# EAGLE design untitled (EAGLE 7.6.0)
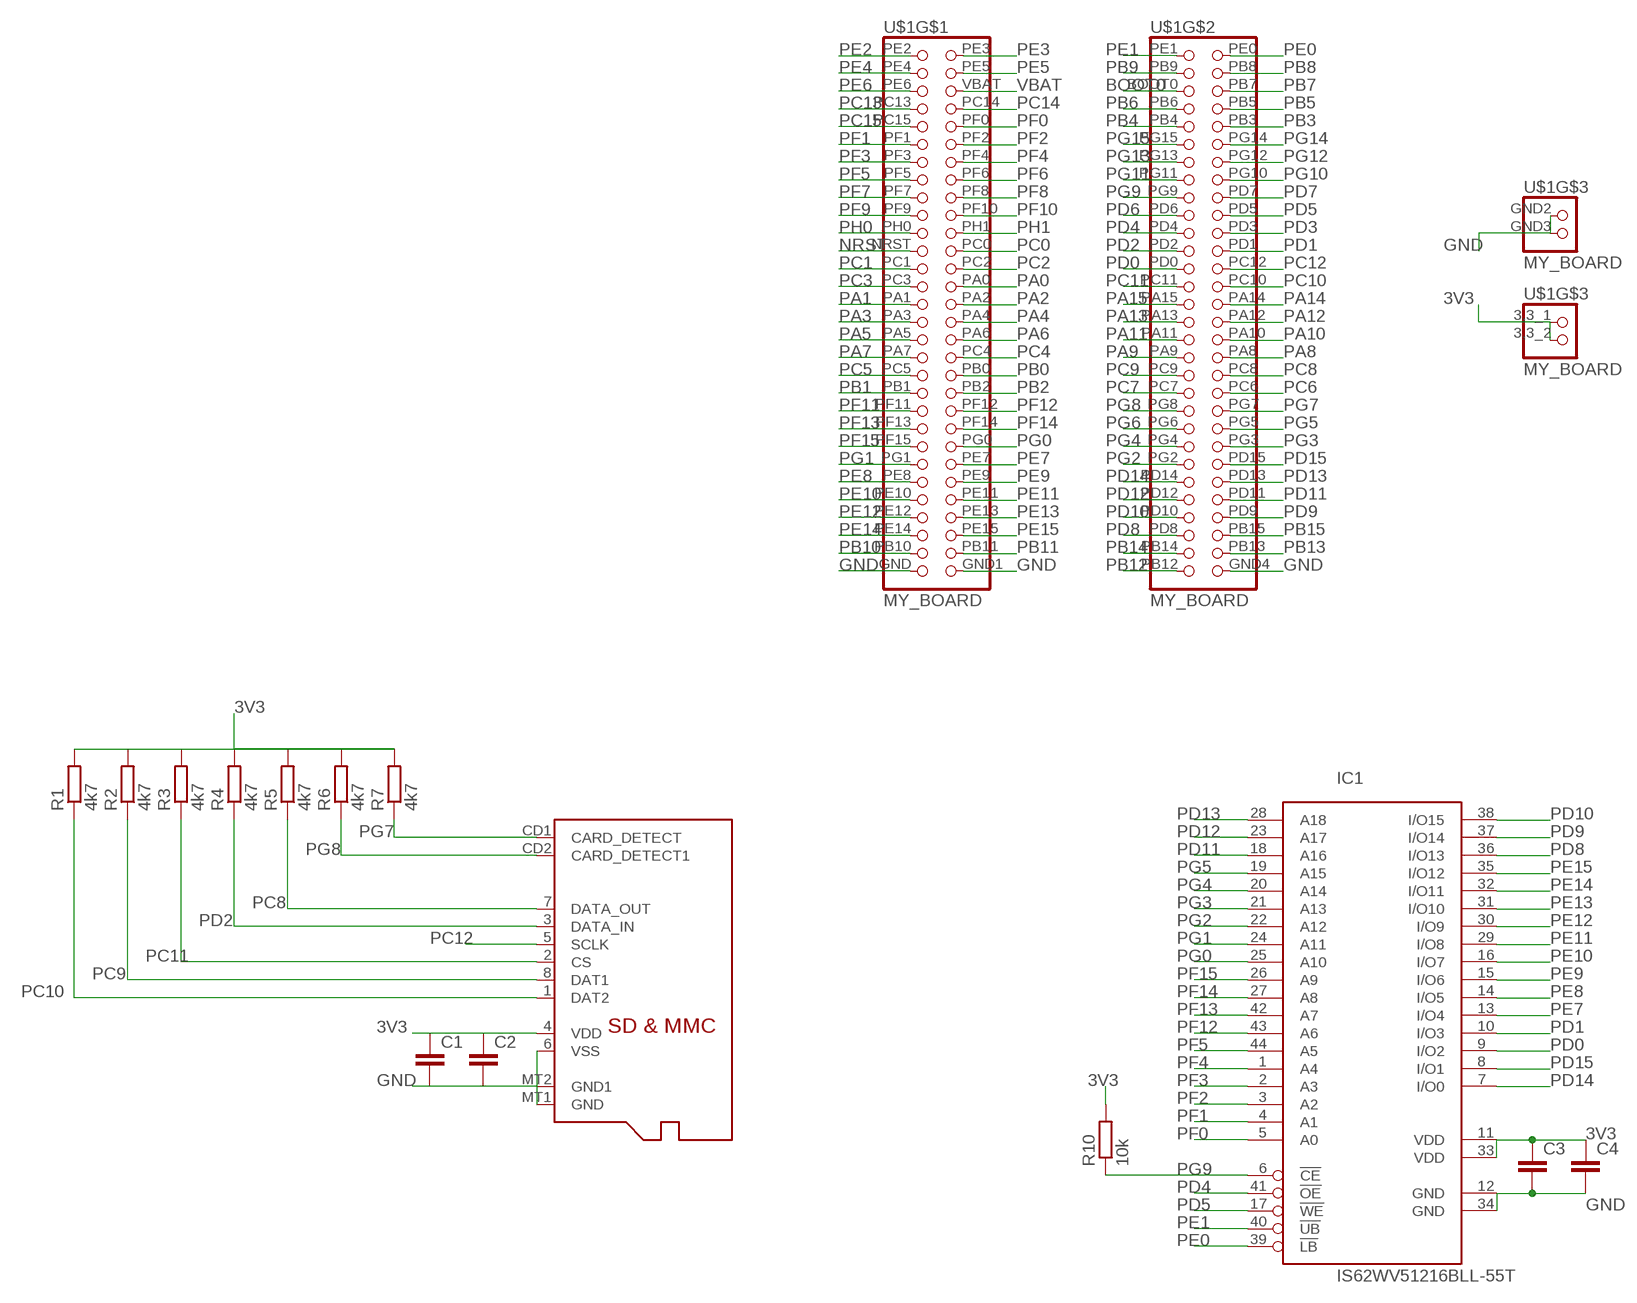
[diagram p0: schematic, sheet 1]

## Parts
C1  C-EUC1206  [C1206]
C2  C-EUC1206  [C1206]
C3  C-EUC1206  [C1206]
C4  C-EUC1206  [C1206]
IC1  IS62WV51216BLL-55T  [TSOP-II-44]
R1  4k7  R-EU_R1206  [R1206]
R2  4k7  R-EU_R1206  [R1206]
R3  4k7  R-EU_R1206  [R1206]
R4  4k7  R-EU_R1206  [R1206]
R5  4k7  R-EU_R1206  [R1206]
R6  4k7  R-EU_R1206  [R1206]
R7  4k7  R-EU_R1206  [R1206]
R10  10k  R-EU_R1206  [R1206]
U$1  MY_BOARD  [MY_BOARD]
U$5  MICROSD  [MICROSD]

## Nets
3V3: C1.1 C2.1 C3.1 C4.1 IC1.11(VDD) IC1.33(VDD) R1.2 R2.2 R3.2 R4.2 R5.2 R6.2 R7.2 R10.2 U$1.3,3_1 U$1.3,3_2 U$5.4(VDD)
BOOT0: U$1.BOOT0
GND: C1.2 C2.2 C3.2 C4.2 IC1.12(GND) IC1.34(GND) U$1.GND U$1.GND1 U$1.GND2 U$1.GND3 U$1.GND4 U$5.6(VSS) U$5.MT1(GND) U$5.MT2(GND1)
NRST: U$1.NRST
PA0: U$1.PA0
PA1: U$1.PA1
PA2: U$1.PA2
PA3: U$1.PA3
PA4: U$1.PA4
PA5: U$1.PA5
PA6: U$1.PA6
PA7: U$1.PA7
PA8: U$1.PA8
PA9: U$1.PA9
PA10: U$1.PA10
PA11: U$1.PA11
PA12: U$1.PA12
PA13: U$1.PA13
PA14: U$1.PA14
PA15: U$1.PA15
PB0: U$1.PB0
PB1: U$1.PB1
PB2: U$1.PB2
PB3: U$1.PB3
PB4: U$1.PB4
PB5: U$1.PB5
PB6: U$1.PB6
PB7: U$1.PB7
PB8: U$1.PB8
PB9: U$1.PB9
PB10: U$1.PB10
PB11: U$1.PB11
PB12: U$1.PB12
PB13: U$1.PB13
PB14: U$1.PB14
PB15: U$1.PB15
PC0: U$1.PC0
PC1: U$1.PC1
PC2: U$1.PC2
PC3: U$1.PC3
PC4: U$1.PC4
PC5: U$1.PC5
PC6: U$1.PC6
PC7: U$1.PC7
PC8: R5.1 U$1.PC8 U$5.7(DATA_OUT)
PC9: R2.1 U$1.PC9 U$5.8(DAT1)
PC10: R1.1 U$1.PC10 U$5.1(DAT2)
PC11: R3.1 U$1.PC11 U$5.2(CS)
PC12: U$1.PC12 U$5.5(SCLK)
PC13: U$1.PC13
PC14: U$1.PC14
PC15: U$1.PC15
PD0: IC1.9(I/O2) U$1.PD0
PD1: IC1.10(I/O3) U$1.PD1
PD2: R4.1 U$1.PD2 U$5.3(DATA_IN)
PD3: U$1.PD3
PD4: IC1.41(!OE) U$1.PD4
PD5: IC1.17(!WE) U$1.PD5
PD6: U$1.PD6
PD7: U$1.PD7
PD8: IC1.36(I/O13) U$1.PD8
PD9: IC1.37(I/O14) U$1.PD9
PD10: IC1.38(I/O15) U$1.PD10
PD11: IC1.18(A16) U$1.PD11
PD12: IC1.23(A17) U$1.PD12
PD13: IC1.28(A18) U$1.PD13
PD14: IC1.7(I/O0) U$1.PD14
PD15: IC1.8(I/O1) U$1.PD15
PE0: IC1.39(!LB) U$1.PE0
PE1: IC1.40(!UB) U$1.PE1
PE2: U$1.PE2
PE3: U$1.PE3
PE4: U$1.PE4
PE5: U$1.PE5
PE6: U$1.PE6
PE7: IC1.13(I/O4) U$1.PE7
PE8: IC1.14(I/O5) U$1.PE8
PE9: IC1.15(I/O6) U$1.PE9
PE10: IC1.16(I/O7) U$1.PE10
PE11: IC1.29(I/O8) U$1.PE11
PE12: IC1.30(I/O9) U$1.PE12
PE13: IC1.31(I/O10) U$1.PE13
PE14: IC1.32(I/O11) U$1.PE14
PE15: IC1.35(I/O12) U$1.PE15
PF0: IC1.5(A0) U$1.PF0
PF1: IC1.4(A1) U$1.PF1
PF2: IC1.3(A2) U$1.PF2
PF3: IC1.2(A3) U$1.PF3
PF4: IC1.1(A4) U$1.PF4
PF5: IC1.44(A5) U$1.PF5
PF6: U$1.PF6
PF7: U$1.PF7
PF8: U$1.PF8
PF9: U$1.PF9
PF10: U$1.PF10
PF11: U$1.PF11
PF12: IC1.43(A6) U$1.PF12
PF13: IC1.42(A7) U$1.PF13
PF14: IC1.27(A8) U$1.PF14
PF15: IC1.26(A9) U$1.PF15
PG0: IC1.25(A10) U$1.PG0
PG1: IC1.24(A11) U$1.PG1
PG2: IC1.22(A12) U$1.PG2
PG3: IC1.21(A13) U$1.PG3
PG4: IC1.20(A14) U$1.PG4
PG5: IC1.19(A15) U$1.PG5
PG6: U$1.PG6
PG7: R7.1 U$1.PG7 U$5.CD1(CARD_DETECT)
PG8: R6.1 U$1.PG8 U$5.CD2(CARD_DETECT1)
PG9: IC1.6(!CE) R10.1 U$1.PG9
PG10: U$1.PG10
PG11: U$1.PG11
PG12: U$1.PG12
PG13: U$1.PG13
PG14: U$1.PG14
PG15: U$1.PG15
PH0: U$1.PH0
PH1: U$1.PH1
VBAT: U$1.VBAT

## Library data of the parts
C1-C4 = resistor:C-EU: CAPACITOR, European symbol
IC1 = memory-issi-asynsram:IS62WV51216BLL-*: 512k x 16 low voltage, ultra low power CMOS static RAM 55ns access time 3.6V power supply
R1-R7 R10 = resistor:R-EU_: RESISTOR, European symbol
U$1 = Stworzone:MY_BOARD
U$5 = adafruit:MICROSD: Micro-SD / Transflash card holder with SPI pinout For the 3M # 2908-05WB-MG and/or 4UCON #19656 push-push type

## Board
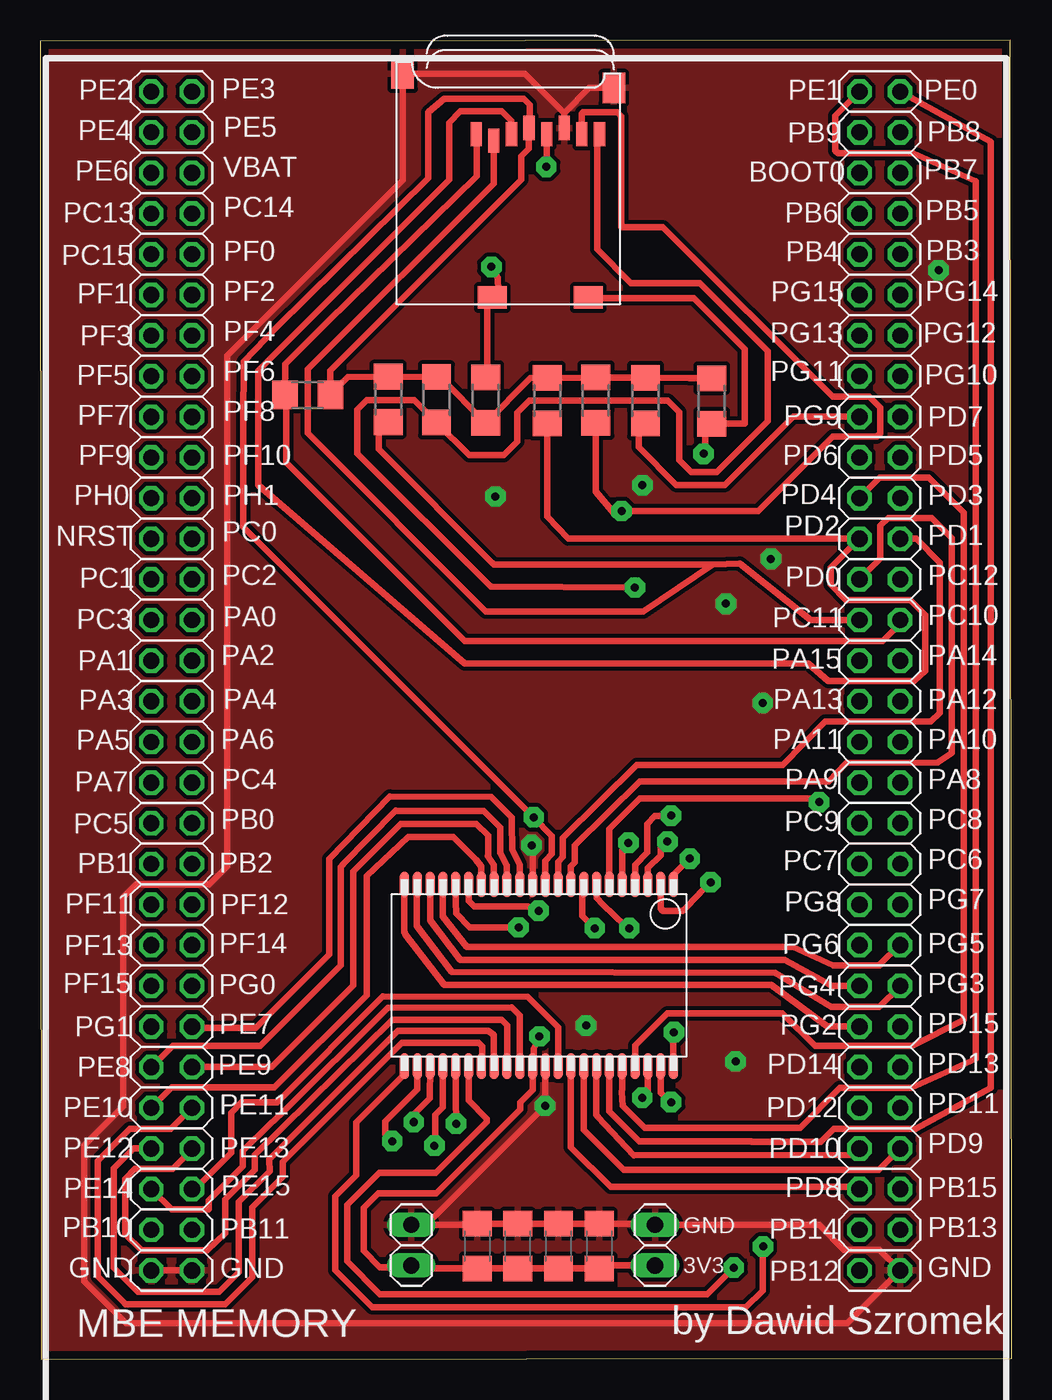
[diagram p1: board, top side]
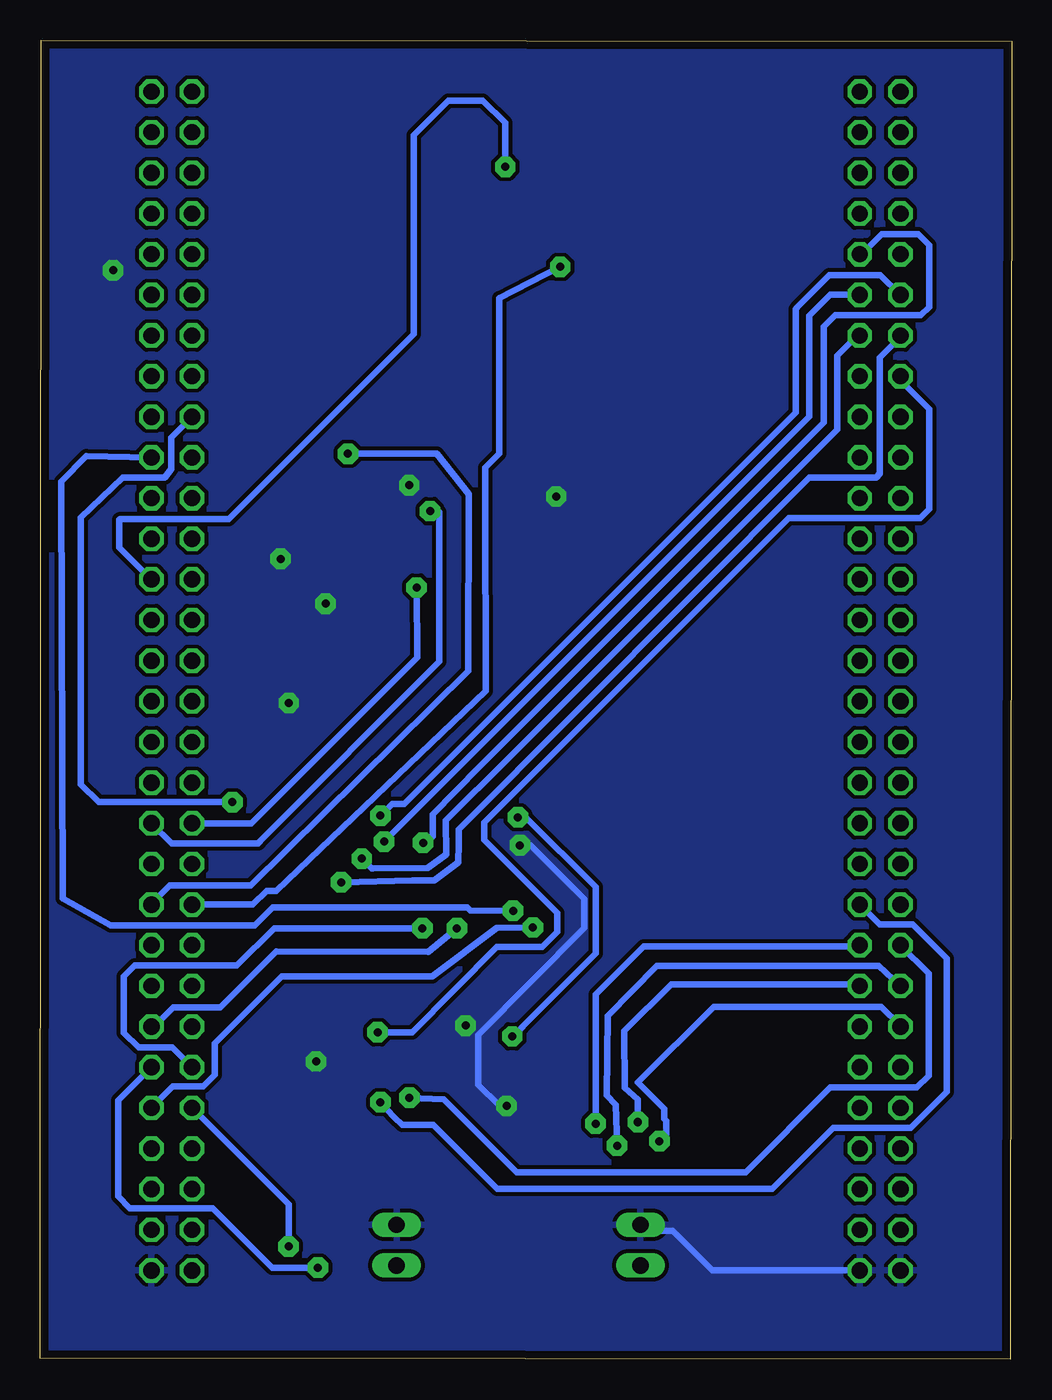
[diagram p2: board, bottom side, seen from below]

Size 60.69 x 82.45 mm. Coordinates in mm from the lower left corner, seen from the top.
Outline: 0.08,0 60.69,0.08 60.61,82.45 0,82.37 0.08,0
Copper layers (1*16): Top 0.035mm / dielectric 1.6mm / Bottom 0.035mm
Design rules "Elecrow_2-layer_PCB_eagle_rule": minimum track width 6mil, minimum drill 12mil, track to track 6mil, track to pad 6mil, pad to pad 6mil, via to via 8mil, smd to smd 0mil, copper to edge 20mil, drill to drill 10mil, minimum pad ring 6mil, minimum via ring 6mil, stop-mask expansion 0mil, vias tented up to drill 100mil, thermal gap 10mil

### Footprints (pad centres in the part's own frame; a part is rotated, then mirrored left to right if it is on the bottom)
C1206 = smd 1.6 x 1.8: 1 -1.4,0; 2 1.4,0
TSOP-II-44 = smd 0.55 x 1.6: 1 -8.4,-5.68; 2 -7.6,-5.68; 3 -6.8,-5.68; 4 -6,-5.68; 5 -5.2,-5.68; 6 -4.4,-5.68; 7 -3.6,-5.68; 8 -2.8,-5.68; 9 -2,-5.68; 10 -1.2,-5.68; 11 -0.4,-5.68; 12 0.4,-5.68; 13 1.2,-5.68; 14 2,-5.68; 15 2.8,-5.68; 16 3.6,-5.68; 17 4.4,-5.68; 18 5.2,-5.68; 19 6,-5.68; 20 6.8,-5.68; 21 7.6,-5.68; 22 8.4,-5.68; 23 8.4,5.68; 24 7.6,5.68; 25 6.8,5.68; 26 6,5.68; 27 5.2,5.68; 28 4.4,5.68; 29 3.6,5.68; 30 2.8,5.68; 31 2,5.68; 32 1.2,5.68; 33 0.4,5.68; 34 -0.4,5.68; 35 -1.2,5.68; 36 -2,5.68; 37 -2.8,5.68; 38 -3.6,5.68; 39 -4.4,5.68; 40 -5.2,5.68; 41 -6,5.68; 42 -6.8,5.68; 43 -7.6,5.68; 44 -8.4,5.68
R1206 = smd 1.6 x 1.803: 1 -1.422,0; 2 1.422,0
MY_BOARD = drill 1.016 long: 3,3_1 12.34,-5.43; 3,3_2 27.57,-5.43; GND2 12.34,-2.89; GND3 27.57,-2.89 | drill 1.016 octagon: BOOT0 40.34,62.84; GND -3.9,-5.74; GND1 -1.36,-5.74; GND4 42.88,-5.74; NRST -3.9,39.98; PA0 -1.36,34.9; PA1 -3.9,32.36; PA2 -1.36,32.36; PA3 -3.9,29.82; PA4 -1.36,29.82; PA5 -3.9,27.28; PA6 -1.36,27.28; PA7 -3.9,24.74; PA8 42.88,24.74; PA9 40.34,24.74; PA10 42.88,27.28; PA11 40.34,27.28; PA12 42.88,29.82; PA13 40.34,29.82; PA14 42.88,32.36; PA15 40.34,32.36; PB0 -1.36,22.2; PB1 -3.9,19.66; PB2 -1.36,19.66; PB3 42.88,57.76; PB4 40.34,57.76; PB5 42.88,60.3; PB6 40.34,60.3; PB7 42.88,62.84; PB8 42.88,65.38; PB9 40.34,65.38; PB10 -3.9,-3.2; PB11 -1.36,-3.2; PB12 40.34,-5.74; PB13 42.88,-3.2; PB14 40.34,-3.2; PB15 42.88,-0.66; PC0 -1.36,39.98; PC1 -3.9,37.44; PC2 -1.36,37.44; PC3 -3.9,34.9; PC4 -1.36,24.74; PC5 -3.9,22.2; PC6 42.88,19.66; PC7 40.34,19.66; PC8 42.88,22.2; PC9 40.34,22.2; PC10 42.88,34.9; PC11 40.34,34.9; PC12 42.88,37.44; PC13 -3.9,60.3; PC14 -1.36,60.3; PC15 -3.9,57.76; PD0 40.34,37.44; PD1 42.88,39.98; PD2 40.34,39.98; PD3 42.88,42.52; PD4 40.34,42.52; PD5 42.88,45.06; PD6 40.34,45.06; PD7 42.88,47.6; PD8 40.34,-0.66; PD9 42.88,1.88; PD10 40.34,1.88; PD11 42.88,4.42; PD12 40.34,4.42; PD13 42.88,6.96; PD14 40.34,6.96; PD15 42.88,9.5; PE0 42.88,67.92; PE1 40.34,67.92; PE2 -3.9,67.92; PE3 -1.36,67.92; PE4 -3.9,65.38; PE5 -1.36,65.38; PE6 -3.9,62.84; PE7 -1.36,9.5; PE8 -3.9,6.96; PE9 -1.36,6.96; PE10 -3.9,4.42; PE11 -1.36,4.42; PE12 -3.9,1.88; PE13 -1.36,1.88; PE14 -3.9,-0.66; PE15 -1.36,-0.66; PF0 -1.36,57.76; PF1 -3.9,55.22; PF2 -1.36,55.22; PF3 -3.9,52.68; PF4 -1.36,52.68; PF5 -3.9,50.14; PF6 -1.36,50.14; PF7 -3.9,47.6; PF8 -1.36,47.6; PF9 -3.9,45.06; PF10 -1.36,45.06; PF11 -3.9,17.12; PF12 -1.36,17.12; PF13 -3.9,14.58; PF14 -1.36,14.58; PF15 -3.9,12.04; PG0 -1.36,12.04; PG1 -3.9,9.5; PG2 40.34,9.5; PG3 42.88,12.04; PG4 40.34,12.04; PG5 42.88,14.58; PG6 40.34,14.58; PG7 42.88,17.12; PG8 40.34,17.12; PG9 40.34,47.6; PG10 42.88,50.14; PG11 40.34,50.14; PG12 42.88,52.68; PG13 40.34,52.68; PG14 42.88,55.22; PG15 40.34,55.22; PH0 -3.9,42.52; PH1 -1.36,42.52; VBAT -1.36,62.84
MICROSD = smd 0.7 x 1.5: 1 9,-10.64; 2 7.9,-10.24; 3 6.8,-10.64; 4 5.7,-11.04; 5 4.6,-10.64; 6 3.5,-11.04; 7 2.4,-10.64; 8 1.3,-10.64 | smd 1.8 x 1.4: CD1 2,-0.44; CD2 8,-0.44 | smd 1.4 x 1.9: MT1 0.4,-13.54; MT2 13.6,-14.44

### Placement (x,y rotation side)
C1  34.92,7.09 90 top
C2  32.38,7.09 90 top
C3  29.84,7.09 90 top
C4  27.3,7.09 90 top
IC1  31.17,24 180 top
R1  16.71,60.27 0 top
R2  24.76,59.97 90 top
R3  21.74,59.99 90 top
R4  31.67,59.92 90 top
R5  34.72,59.94 90 top
R6  27.84,59.94 270 top
R7  41.96,59.89 90 top
R10  37.82,59.92 90 top
U$1  10.85,11.3 0 top
U$5  36.25,65.91 180 top

### Tracks (layer width: path | path; a pad name or v marks a point on that pad's centre or on a via)
3V3  (via drill 0.5 pad 1.27)
  Top 0.406: IC1.11 31.57,31.16 31.95,31.6 31.95,32.72 v30.84,33.88 12.7,52.02 12.7,60.1 12.73,60.81 12.73,62.36 14.78,64.52 24.26,73.81 24.26,77.95 25.25,78.79 30.2,78.79 30.58,78.41 30.58,76.99 U$5.4 30.53,76.94 30.53,75.67 30.05,75.18 30.05,73.74 18.11,61.8 R1.2 19.23,61.4 R3.2 24.74,61.4 R2.2 25.01,61.37 R6.2 | v31.19,20.19 30.84,19.41 30.81,18.37 IC1.33 30.77,16.85 30,16.08 30,15.62 24.76,10.39 21.13,10.39 20.22,9.47 20.22,6.78 21.23,5.77 23.08,5.77 U$1.3,3_1 23.37,5.69 C4.1 C3.1 C2.1 C1.1 35.11,5.87 U$1.3,3_2 | R4.2 34.24,61.32 R5.2 37.39,61.34 R10.2 40.56,61.32 R7.2 | R4.2 30.61,61.32 R6.2 | 27.81,58.57 R6.2 | 31.17,61.34 R4.2
  Bottom 0.406: v30.84,33.88 30.35,33.88 25.98,29.52 25.98,25.38 30.61,20.75 30.56,20.75 v31.19,20.19
GND  (via drill 0.5 pad 1.27)
  Top 0.406: IC1.12 30.77,31.87 v30.71,32.13 | IC1.34 31.55,18.3 v31.55,15.85 24.11,8.41 U$1.GND2 27.23,8.41 C4.2 C3.2 C2.2 C1.2 38.34,8.49 U$1.GND3 48.69,8.41 50.22,6.86 52.41,6.86 U$1.GND4 50.42,2.26 5.38,2.26 2.77,4.88 2.77,13.39 5.21,15.82 5.21,28.91 5.99,29.69 10.57,29.69 11.68,30.81 11.68,62.74 22.65,73.7 U$5.MT2 30.26,80.35 32.74,77.88 | U$1.GND U$1.GND1 | U$5.MT1 34.32,79.45 32.74,77.88 | 32.74,77.88 U$5.6
  Bottom 0.406: v30.71,32.13 30.02,32.11 26.7,28.78 26.7,26.98 33.3,20.27 33.3,17.17 32,15.88 31.52,15.88 v31.55,15.85 | U$1.GND1 18.69,5.56 21.16,8.03 22.8,8.03 U$1.GND2
  other vias: 56.13,68.05 28.45,53.92 42.85,47.22 45.15,41.02 43.45,18.62 45.66,50.02 37.63,54.62 34.11,20.86
  pour Top (isolate 0.254): 0.05,82.32 60.65,82.32 60.85,0.02 0.05,0.02
  pour Bottom (isolate 0.254): 60.65,82.42 0.05,82.42 -0.15,0.12 60.65,0.12
PC8  (via drill 0.5 pad 1.27)
  Top 0.406: U$5.7 33.83,76.57 33.83,77.85 33.91,77.93 36.04,77.93 36.3,77.67 36.3,70.76 38.91,70.76 49.5,60.17 51.79,60.17 52.48,59.49 52.48,57.86 52.27,57.66 49.5,57.66 44.86,53.01 v36.32,53.01 35.86,52.86 34.72,54.23 R5.1 34.37,58.54
  Bottom 0.406: U$1.PC8 52.46,32.23 47.07,32.23 46.96,32.33 46.96,32.36 35.76,43.61 35.76,52.96 v36.32,53.01
PC9  (via drill 0.5 pad 1.27)
  Top 0.406: v37.16,48.24 28.19,48.29 28.14,48.29 19.81,56.62 19.81,59.36 20.4,59.94 23.39,59.94 R2.1 26.82,56.51 28.96,56.51 29.79,57.35 29.79,59.16 30.56,59.92 39.22,59.92 39.93,59.21 39.93,56.18 40.67,55.45 42.27,55.45 45.44,58.62 45.44,63.02 41.2,67.26 36.91,67.26 34.8,69.37 34.8,76.41 U$5.8
  Bottom 0.406: U$1.PC9 47.5,33.5 37.13,43.87 v37.16,48.24
PC10
  Top 0.406: U$5.1 27.28,76.52 27.28,73.94 17.96,64.85 15.31,62.2 R1.1 15.37,60.22 15.37,56.06 26.52,44.91 52.65,44.91 53.73,45.98 U$1.PC10
PC11
  Top 0.406: 28.32,49.73 28.35,49.68 | 28.35,49.68 42.01,49.68 | 42.01,49.68 43.71,49.73 48.13,46.2 U$1.PC11 | U$5.2 28.35,73.48 16.74,61.87 16.71,57.89 27.84,46.74 37.67,46.74 42.01,49.68 | R3.1 21.36,58.04 21.17,58.03 21.17,56.88 28.35,49.68
PC12  (via drill 0.5 pad 1.27)
  Top 0.406: v31.62,74.52 31.65,74.55 U$5.5
  Bottom 0.406: U$1.PC12 55.73,50.74 55.73,52.48 55.68,52.53 48.89,52.53 37.34,64.08 37.34,76.5 35.18,78.66 33.02,78.66 31.62,77.27 v31.62,74.52
PD0
  Top 0.406: U$1.PD0 52.48,50.03 52.48,52.12 52.98,52.58 55.7,52.58 56.95,51.33 56.95,37.9 56.08,37.31 50.37,37.29 49.28,36.12 37.46,36.12 33.4,32.13 33.4,31.06 33.15,30.81 33.15,29.7 IC1.9
PD1
  Top 0.406: IC1.10 32.37,31.1 32.66,31.39 32.66,32.59 37.29,37.16 46.38,37.16 49.05,39.88 55.65,39.85 56.21,40.39 56.21,49.79 54.72,51.28 U$1.PD1 53.73,51.33
PD2
  Top 0.406: U$5.3 29.45,77.41 28.85,78 26.26,78 25.55,77.29 25.55,73.74 13.64,61.8 13.64,54.63 26.54,43.48 47.98,43.48 49.22,42.39 54.61,42.39 55.3,43.03 55.3,46.51 54.36,47.45 50.34,47.45 49.38,48.41 49.38,49.48 U$1.PD2 32.99,51.28 31.67,52.68 R4.1
PD4
  Top 0.406: IC1.41 37.17,19.64 39.17,21.64 46.35,21.64 48.41,19.58 54.48,19.58 57.71,21.21 57.71,52.91 55.52,55.09 52.46,55.09 U$1.PD4
PD5  (via drill 0.5 pad 1.27)
  Top 0.406: IC1.17 26.77,28.66 27.13,28.3 30.48,28.3 v31.14,28.04
  Bottom 0.406: v31.14,28.04 33.81,28.07 33.98,28.24 46.15,28.24 47.27,27.13 56.26,27.13 59.26,28.8 59.36,54.77 59.36,54.86 57.78,56.44 U$1.PD5
PD8
  Top 0.406: IC1.36 33.17,13.27 35.64,10.8 51.03,10.8 U$1.PD8
PD9
  Top 0.406: IC1.37 33.97,14.34 36.45,11.86 52.4,11.86 U$1.PD9
PD10
  Top 0.406: U$1.PD10 50.95,13.18 50.7,12.78 37.08,12.75 34.85,15.16 34.85,15.19 34.75,15.29 34.75,18.3 IC1.38
PD11  (via drill 0.5 pad 1.27)
  Top 0.406: IC1.18 25.97,28.59 25.98,27.86 26.85,27 v29.9,27
  Bottom 0.406: v29.9,27 32.16,26.98 36.19,23.95 45.59,23.95 49.78,19.76 49.78,17.78 50.49,17.07 52.38,17.07 U$1.PD11
PD12  (via drill 0.5 pad 1.27)
  Top 0.406: IC1.23 22.77,17.81 19.76,14.81 19.76,11.51 18.44,10.18 18.44,5.56 20.75,3.25 44.09,3.25 45.14,4.29 45.14,7.04 v45.16,7.06
  Bottom 0.406: v45.16,7.06 45.16,9.7 U$1.PD12
PD13  (via drill 0.5 pad 1.27)
  Top 0.406: IC1.28 26.77,16.19 27.91,15.04 27.91,14.86 24.71,11.66 21.18,11.66 19.2,9.68 19.2,6.12 21.23,4.09 41.68,4.09 v43.33,5.74
  Bottom 0.406: v43.33,5.74 46.18,5.74 49.89,9.45 55.07,9.45 55.8,10.18 55.8,16.19 U$1.PD13
PD14  (via drill 0.5 pad 1.27)
  Top 0.406: IC1.7 34.77,28.84 35.15,28.45 35.15,28.42 36.52,27.13 36.63,27.13 v36.8,26.95
  Bottom 0.406: v36.8,26.95 46.05,26.95 48.39,24.61 54.76,24.61 55.45,23.93 55.45,20.42 54.53,19.51 52.43,19.51 U$1.PD14
PD15  (via drill 0.5 pad 1.27)
  Top 0.406: IC1.8 33.88,29.54 33.88,27.71 v34.65,26.95
  Bottom 0.406: U$1.PD15 53.54,20.8 52.35,22 49.43,22 45.92,25.5 36.45,25.48 v34.65,26.95
PE0
  Top 0.406: IC1.39 35.57,15.51 37.44,13.64 44.42,13.64 44.45,13.61 48.77,13.61 49.58,14.43 54.71,14.43 59.38,16.97 59.38,76.1 U$1.PE0
PE1
  Top 0.406: IC1.40 36.37,16.91 36.35,16.74 36.4,15.85 37.77,14.48 47.47,14.48 49.96,16.97 54.41,16.97 58.45,18.8 58.45,73.63 54.56,75.36 49.86,75.36 49.68,75.54 49.68,77.72 U$1.PE1
PE7
  Top 0.406: IC1.13 29.97,30.91 29.49,31.88 29.46,33.55 29.46,33.88 28.19,35.15 21.84,35.18 18.06,31.27 18.06,25.32 13.46,20.73 9.56,20.73 U$1.PE7
PE8
  Top 0.406: IC1.14 29.17,30.46 29.16,30.86 28.75,31.65 28.75,33.25 27.71,34.29 22.25,34.29 22.22,34.31 18.9,30.94 18.9,30.91 18.77,30.79 18.77,24.61 13.77,19.58 8.29,19.58 U$1.PE8
PE9
  Top 0.406: IC1.15 28.34,30.91 27.97,31.47 27.99,31.5 27.99,32.74 27.25,33.48 22.53,33.48 19.56,30.51 19.56,23.37 14.48,18.29 9.51,18.29 U$1.PE9
PE10
  Top 0.406: IC1.16 27.57,30.82 27.2,31.24 25.81,32.64 22.99,32.64 20.4,30.2 20.4,22.76 14.63,16.99 8.22,16.99 U$1.PE10
PE11
  Top 0.406: U$1.PE11 8.18,14.43 5.61,14.43 3.61,12.42 3.61,5.21 5.26,3.56 5.26,3.53 5.33,3.45 11.58,3.45 13.26,5.13 13.26,9.5 15.16,11.41 15.16,12.34 22.61,19.79 27.41,19.79 27.63,19.56 27.63,18.39 IC1.29
PE12
  Top 0.406: U$1.PE12 5.84,13.18 4.6,11.94 4.6,5.74 6.1,4.24 11.2,4.24 12.42,5.46 12.42,9.86 14.35,11.76 14.33,12.5 22.35,20.52 27.99,20.52 28.35,20.3 28.35,18.34 IC1.30 28.47,18.43
PE13
  Top 0.406: U$1.PE13 9.49,13.09 8.31,11.91 5.92,11.91 5.31,11.3 5.31,7.82 6.35,6.83 10.44,6.83 11.56,7.9 11.56,10.01 13.41,11.86 13.41,12.78 22,21.23 28.83,21.23 29.18,20.88 29.18,18.34 IC1.31 29.21,18.37
PE14
  Top 0.406: U$1.PE14 8.24,9.4 8.38,9.37 10.54,9.37 10.54,9.93 12.65,12.07 12.67,13.03 14.35,14.71 15.09,15.39 21.72,21.97 29.46,22 29.97,21.49 IC1.32 29.92,18.37
PE15
  Top 0.406: U$1.PE15 9.68,10.64 11.94,12.9 11.94,15.42 12.57,16.05 14.81,16.08 21.41,22.68 30.45,22.66 32.37,20.75 IC1.35
PF0  (via drill 0.5 pad 1.27)
  Top 0.406: IC1.5 36.37,31.82 v36.75,32.28
  Bottom 0.406: v36.75,32.28 36.17,32.69 36.17,33.33 36.14,34.06 33.25,37.03 11.73,58.55 11.73,64.54 11.02,65.25 5.66,65.25 5.16,65.76 5.16,69.62 5.84,70.31 8.1,70.31 9.35,69.06 U$1.PF0 9.49,68.97
PF1  (via drill 0.5 pad 1.27)
  Top 0.406: IC1.4 37.17,30.92 37.92,31.67 37.92,33.48 38.4,33.96 38.61,33.96 v39.42,33.98
  Bottom 0.406: U$1.PF1 8.19,67.77 11.38,67.77 13.41,65.74 13.41,65.71 13.49,65.63 13.49,59.18 37.95,34.72 38.68,34.72 v39.42,33.98
PF2  (via drill 0.5 pad 1.27)
  Top 0.406: IC1.3 37.97,30.7 38.76,31.5 38.76,32 v39.19,32.36
  Bottom 0.406: v39.19,32.36 12.62,58.93 12.62,65.23 11.33,66.52 U$1.PF2
PF3  (via drill 0.5 pad 1.27)
  Top 0.406: IC1.2 38.77,28.19 38.91,28.04 40.13,28.04 41.22,29.13 41.22,29.16 v41.88,29.82
  Bottom 0.406: v41.88,29.82 37.39,29.92 36.07,29.92 34.57,31.06 34.54,32.26 34.54,33.12 12.65,55.12 8.46,55.12 8.23,55.35 8.23,62.61 6.95,63.9 U$1.PF3
PF4  (via drill 0.5 pad 1.27)
  Top 0.406: IC1.1 39.57,30.27 v40.59,31.29
  Bottom 0.406: v40.59,31.29 39.98,30.68 39.9,30.68 36.47,30.71 35.31,31.57 35.33,33.68 31.42,37.59 31.39,37.59 10.9,58.09 10.9,62.71 9.63,63.98 U$1.PF4
PF5  (via drill 0.5 pad 1.27)
  Top 0.406: IC1.44 39.57,20.45 v39.6,20.45
  Bottom 0.406: v39.6,20.45 37.44,20.45 32.16,25.78 29.31,25.78 28.37,26.72 28.37,27.89 32.94,32.46 32.94,33.55 13.92,52.58 5.69,52.58 5.13,53.14 5.13,59.38 6.95,61.2 U$1.PF5
PF12  (via drill 0.5 pad 1.27)
  Top 0.406: IC1.43 38.77,16.67 v39.42,16.08
  Bottom 0.406: v39.42,16.08 38.56,15.14 38.07,14.66 36.12,14.66 32.13,10.67 14.93,10.67 11.12,14.48 6.3,14.48 4.06,16.71 4.06,25.07 6.17,27.18 8.24,27.18 U$1.PF12
PF13  (via drill 0.5 pad 1.27)
  Top 0.406: IC1.42 37.97,16.76 v37.62,16.36
  Bottom 0.406: v37.62,16.36 35.46,16.26 30.91,11.71 16.61,11.71 11.33,16.99 5.92,16.99 5.18,17.73 5.18,24.12 U$1.PF13
PF14  (via drill 0.5 pad 1.27)
  Top 0.406: IC1.27 25.97,16.38 v25.98,14.73
  Bottom 0.406: v25.98,14.73 25.98,22.81 22.99,25.81 9.56,25.81 U$1.PF14
PF15  (via drill 0.5 pad 1.27)
  Top 0.406: IC1.26 25.17,15.77 24.69,15.29 24.69,13.41 v24.64,13.36
  Bottom 0.406: v24.64,13.36 24.71,15.93 25.3,16.51 25.22,21.46 22.17,24.59 8.29,24.59 U$1.PF15
PG0  (via drill 0.5 pad 1.27)
  Top 0.406: IC1.25 24.34,16.31 23.39,15.37 23.42,15.34 v23.34,14.83
  Bottom 0.406: v23.34,14.83 23.34,16.26 24.16,16.97 24.18,20.52 21.26,23.44 9.59,23.44 U$1.PG0
PG1  (via drill 0.5 pad 1.27)
  Top 0.406: IC1.24 23.57,16.89 21.56,14.88 21.56,14.07 v22,13.64
  Bottom 0.406: v22,13.64 21.56,14.07 21.56,14.91 21.69,15.04 21.69,15.67 23.34,17.32 18.62,22.05 8.13,22.05 6.95,20.87 U$1.PG1
PG2
  Top 0.406: IC1.22 22.77,26.69 22.78,26.7 22.81,26.57 25.25,23.39 45.67,23.39 49.17,20.8 U$1.PG2 | U$1.PG2
PG3
  Top 0.406: U$1.PG3 53.73,23.32 52.43,22.02 49.43,22.02 45.92,24.16 25.73,24.21 23.55,27.1 23.55,29.66 IC1.21
PG4
  Top 0.406: IC1.20 24.37,27.45 26.24,24.97 46.51,24.97 49.35,23.39 49.4,23.34 U$1.PG4
PG5
  Top 0.406: U$1.PG5 53.67,25.88 52.48,24.71 52.45,24.61 49.56,24.61 47.02,25.78 26.64,25.78 25.15,27.69 25.15,29.66 IC1.19
PG7  (via drill 0.5 pad 1.27)
  Top 0.406: v41.45,56.59 41.55,57.13 41.58,58.24 R7.1 44.01,58.49 44.01,63.15 40.84,66.32 34.28,66.32 U$5.CD1
  Bottom 0.406: U$1.PG7 53.73,28.47 52.58,29.62 47.52,29.62 33.93,43.03 33.91,54.08 35.89,56.59 v41.45,56.59
PG8  (via drill 0.5 pad 1.27)
  Top 0.406: v28.19,68.28 28.6,67.62 28.66,65.94 U$5.CD2 27.93,66.04 27.93,61.34 R6.1
  Bottom 0.406: U$1.PG8 47.4,28.42 46.53,29.29 45.92,29.29 32.84,41.76 32.87,53.82 32.87,55.73 32,56.59 32,66.32 v28.19,68.28
PG9  (via drill 0.5 pad 1.27)
  Top 0.406: IC1.6 35.57,33.15 37.46,35.05 48.67,35.05 v48.67,34.82 | U$1.PG9 47.04,58.9 42.77,54.63 39.75,54.63 37.39,57 37.39,58.49 R10.1
  Bottom 0.406: v48.67,34.82 57.02,34.82 58.14,35.92 58.14,52.6 55.52,55.12 52.91,55.12 52.48,55.63 52.48,57.61 U$1.PG9

### Text on the board
tNames: PE2 | PE3 | PE1 | PE0 | PE5 | PE4 | PB9 | PB8 | PE6 | VBAT | BOOT0 | PB7 | PC14 | PC13 | PB6 | PB5 | PC15 | PF0 | PB4 | PB3 | PF1 | PF2 | PG15 | PG14 | PF3 | PF4 | PG13 | PG12 | PF5 | PF6 | PG11 | PG10 | PF7 | PF8 | PG9 | PD7 | PF9 | PF10 | PD6 | PD5 | PH0 | PH1 | PD4 | PD3 | PD2 | NRST | PC0 | PD1 | PC2 | PC12 | PC1 | PD0 | PC3 | PA0 | PC11 | PC10 | PA2 | PA14 | PA1 | PA15 | PA3 | PA4 | PA13 | PA12 | PA5 | PA6 | PA11 | PA10 | PA7 | PC4 | PA9 | PA8 | PC5 | PB0 | PC9 | PC8 | PB1 | PB2 | PC7 | PC6 | PF11 | PF12 | PG8 | PG7 | PF14 | PG6 | PG5 | PF13 | PF15 | PG0 | PG4 | PG3 | PE7 | PD15 | PG1 | PG2 | PE8 | PE9 | PD14 | PD13 | PD11 | PE10 | PE11 | PD12 | PE12 | PE13 | PD10 | PD9 | PE14 | PE15 | PD8 | PB15 | PB10 | PB11 | GND | PB14 | PB13 | 3V3 | GND | GND | PB12 | GND | MBE MEMORY | by Dawid Szromek